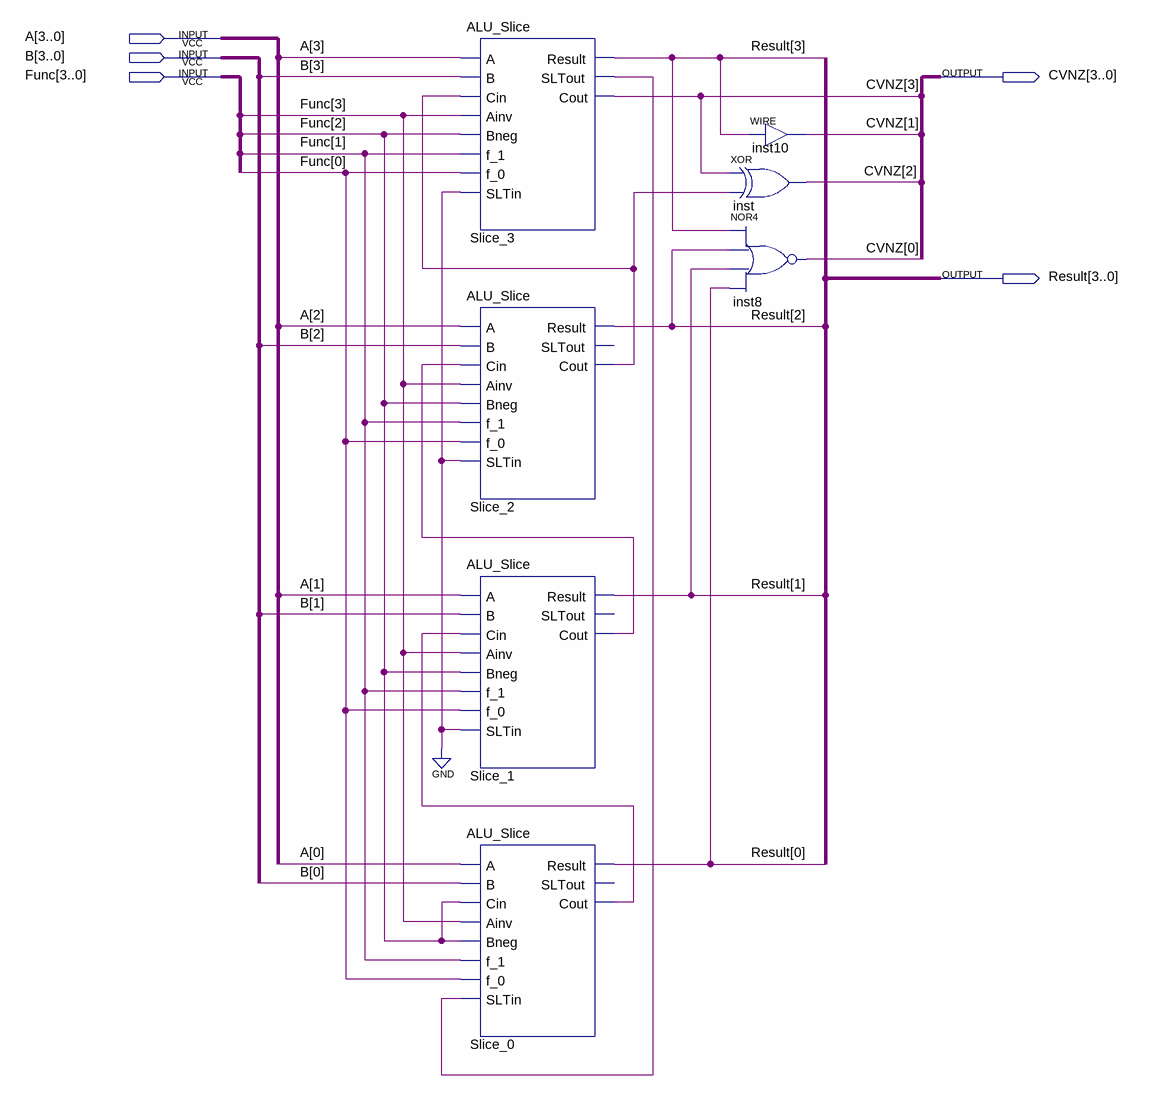
[diagram p0: schematic sheet]
// Quartus schematic MIPS_ALU.bdf as structural Verilog: 7 symbols, 5 pins
module MIPS_ALU (
  input  [3:0] A,
  input  [3:0] B,
  input  [3:0] Func,
  output [3:0] CVNZ,
  output [3:0] Result
);

  wire Slice_0_cout, Slice_1_cout, Slice_2_cout, Slice_3_sltout;

  ALU_Slice Slice_3 (
    .A(A[3]), .B(B[3]), .Cin(Slice_2_cout), .Ainv(Func[3]), .Bneg(Func[2]), .f_1(Func[1]), .f_0(Func[0]),
    .SLTin(1'b0), .Result(Result[3]), .SLTout(Slice_3_sltout), .Cout(CVNZ[3]));
  ALU_Slice Slice_2 (
    .A(A[2]), .B(B[2]), .Cin(Slice_1_cout), .Ainv(Func[3]), .Bneg(Func[2]), .f_1(Func[1]), .f_0(Func[0]),
    .SLTin(1'b0), .Result(Result[2]), .Cout(Slice_2_cout));  // open: SLTout
  ALU_Slice Slice_1 (
    .A(A[1]), .B(B[1]), .Cin(Slice_0_cout), .Ainv(Func[3]), .Bneg(Func[2]), .f_1(Func[1]), .f_0(Func[0]),
    .SLTin(1'b0), .Result(Result[1]), .Cout(Slice_1_cout));  // open: SLTout
  ALU_Slice Slice_0 (
    .A(A[0]), .B(B[0]), .Cin(Func[2]), .Ainv(Func[3]), .Bneg(Func[2]), .f_1(Func[1]), .f_0(Func[0]),
    .SLTin(Slice_3_sltout), .Result(Result[0]), .Cout(Slice_0_cout));  // open: SLTout
  xor inst (CVNZ[2], CVNZ[3], Slice_2_cout);
  nor inst8 (CVNZ[0], Result[3], Result[2], Result[1], Result[0]);
  assign CVNZ[1] = Result[3];  // WIRE inst10
endmodule
